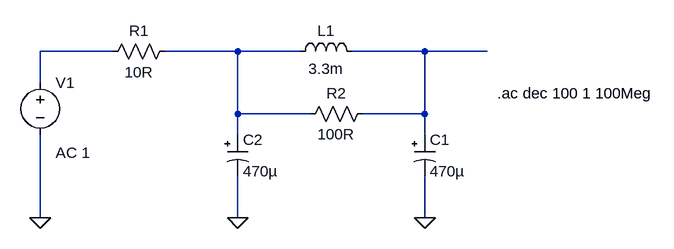
[diagram p0: schematic LC-Filter.asc]
LC-Filter.asc, the LTspice schematic file:
Version 4
SHEET 1 880 680
WIRE -240 96 -352 96
WIRE -48 96 -160 96
WIRE 48 96 -48 96
WIRE 240 96 128 96
WIRE 336 96 240 96
WIRE -352 144 -352 96
WIRE -48 192 -48 96
WIRE 64 192 -48 192
WIRE 240 192 240 96
WIRE 240 192 144 192
WIRE -48 224 -48 192
WIRE 240 224 240 192
WIRE -352 352 -352 224
WIRE -48 352 -48 288
WIRE 240 352 240 288
FLAG 240 352 0
FLAG -48 352 0
FLAG -352 352 0
SYMBOL ind 32 112 R270
WINDOW 0 32 56 VTop 2
WINDOW 3 5 56 VBottom 2
SYMATTR InstName L1
SYMATTR Value 3.3m
SYMATTR SpiceLine Ipk=0.024 Rser=11 Rpar=631701 Cpar=0 mfg="Bourns, Inc." pn="SRR6603-332ML"
SYMBOL polcap 224 224 R0
WINDOW 3 24 56 Left 2
SYMATTR InstName C1
SYMATTR Value 470µ
SYMATTR Description Capacitor
SYMATTR Type cap
SYMATTR SpiceLine V=2 Irms=2.16217 Rser=0.04 Lser=0 mfg="KEMET" pn="T520V477M002ATE040" type="Tantalum"
SYMBOL voltage -352 128 R0
WINDOW 123 24 124 Left 2
WINDOW 39 0 0 Left 0
SYMATTR Value2 AC 1
SYMATTR InstName V1
SYMATTR Value ""
SYMBOL polcap -64 224 R0
WINDOW 3 24 56 Left 2
SYMATTR InstName C2
SYMATTR Value 470µ
SYMATTR Description Capacitor
SYMATTR Type cap
SYMATTR SpiceLine V=2 Irms=2.16217 Rser=0.04 Lser=0 mfg="KEMET" pn="T520V477M002ATE040" type="Tantalum"
SYMBOL res -144 80 R90
WINDOW 0 0 56 VBottom 2
WINDOW 3 32 56 VTop 2
SYMATTR InstName R1
SYMATTR Value 10R
SYMBOL res 160 176 R90
WINDOW 0 0 56 VBottom 2
WINDOW 3 32 56 VTop 2
SYMATTR InstName R2
SYMATTR Value 100R
TEXT 352 160 Left 2 !.ac dec 100 1 100Meg

The netlist it stands for:
* LC-Filter.asc
L1 N002 N003 3.3m Ipk=0.024 Rser=11 Rpar=631701 Cpar=0 mfg="Bourns, Inc." pn="SRR6603-332ML"
C1 N003 0 470µ V=2 Irms=2.16217 Rser=0.04 Lser=0 mfg="KEMET" pn="T520V477M002ATE040" type="Tantalum"
V1 N001 0 AC 1
C2 N002 0 470µ V=2 Irms=2.16217 Rser=0.04 Lser=0 mfg="KEMET" pn="T520V477M002ATE040" type="Tantalum"
R1 N002 N001 10R
R2 N003 N002 100R
.ac dec 100 1 100Meg
.backanno
.end